# Altium schematic sheet cpu.SchDoc: CPU Scheme
size A3; Author: Daniele Basile <asterix24@gmail.com>; Organization: Altium Limited; Address1: L3, 12a Rodborough Rd; Address2: Frenchs Forest; Address3: NSW; Address4: Australia 2086; DocumentNumber: 1; Revision: Rev.A; SheetNumber: 1; SheetTotal: 2
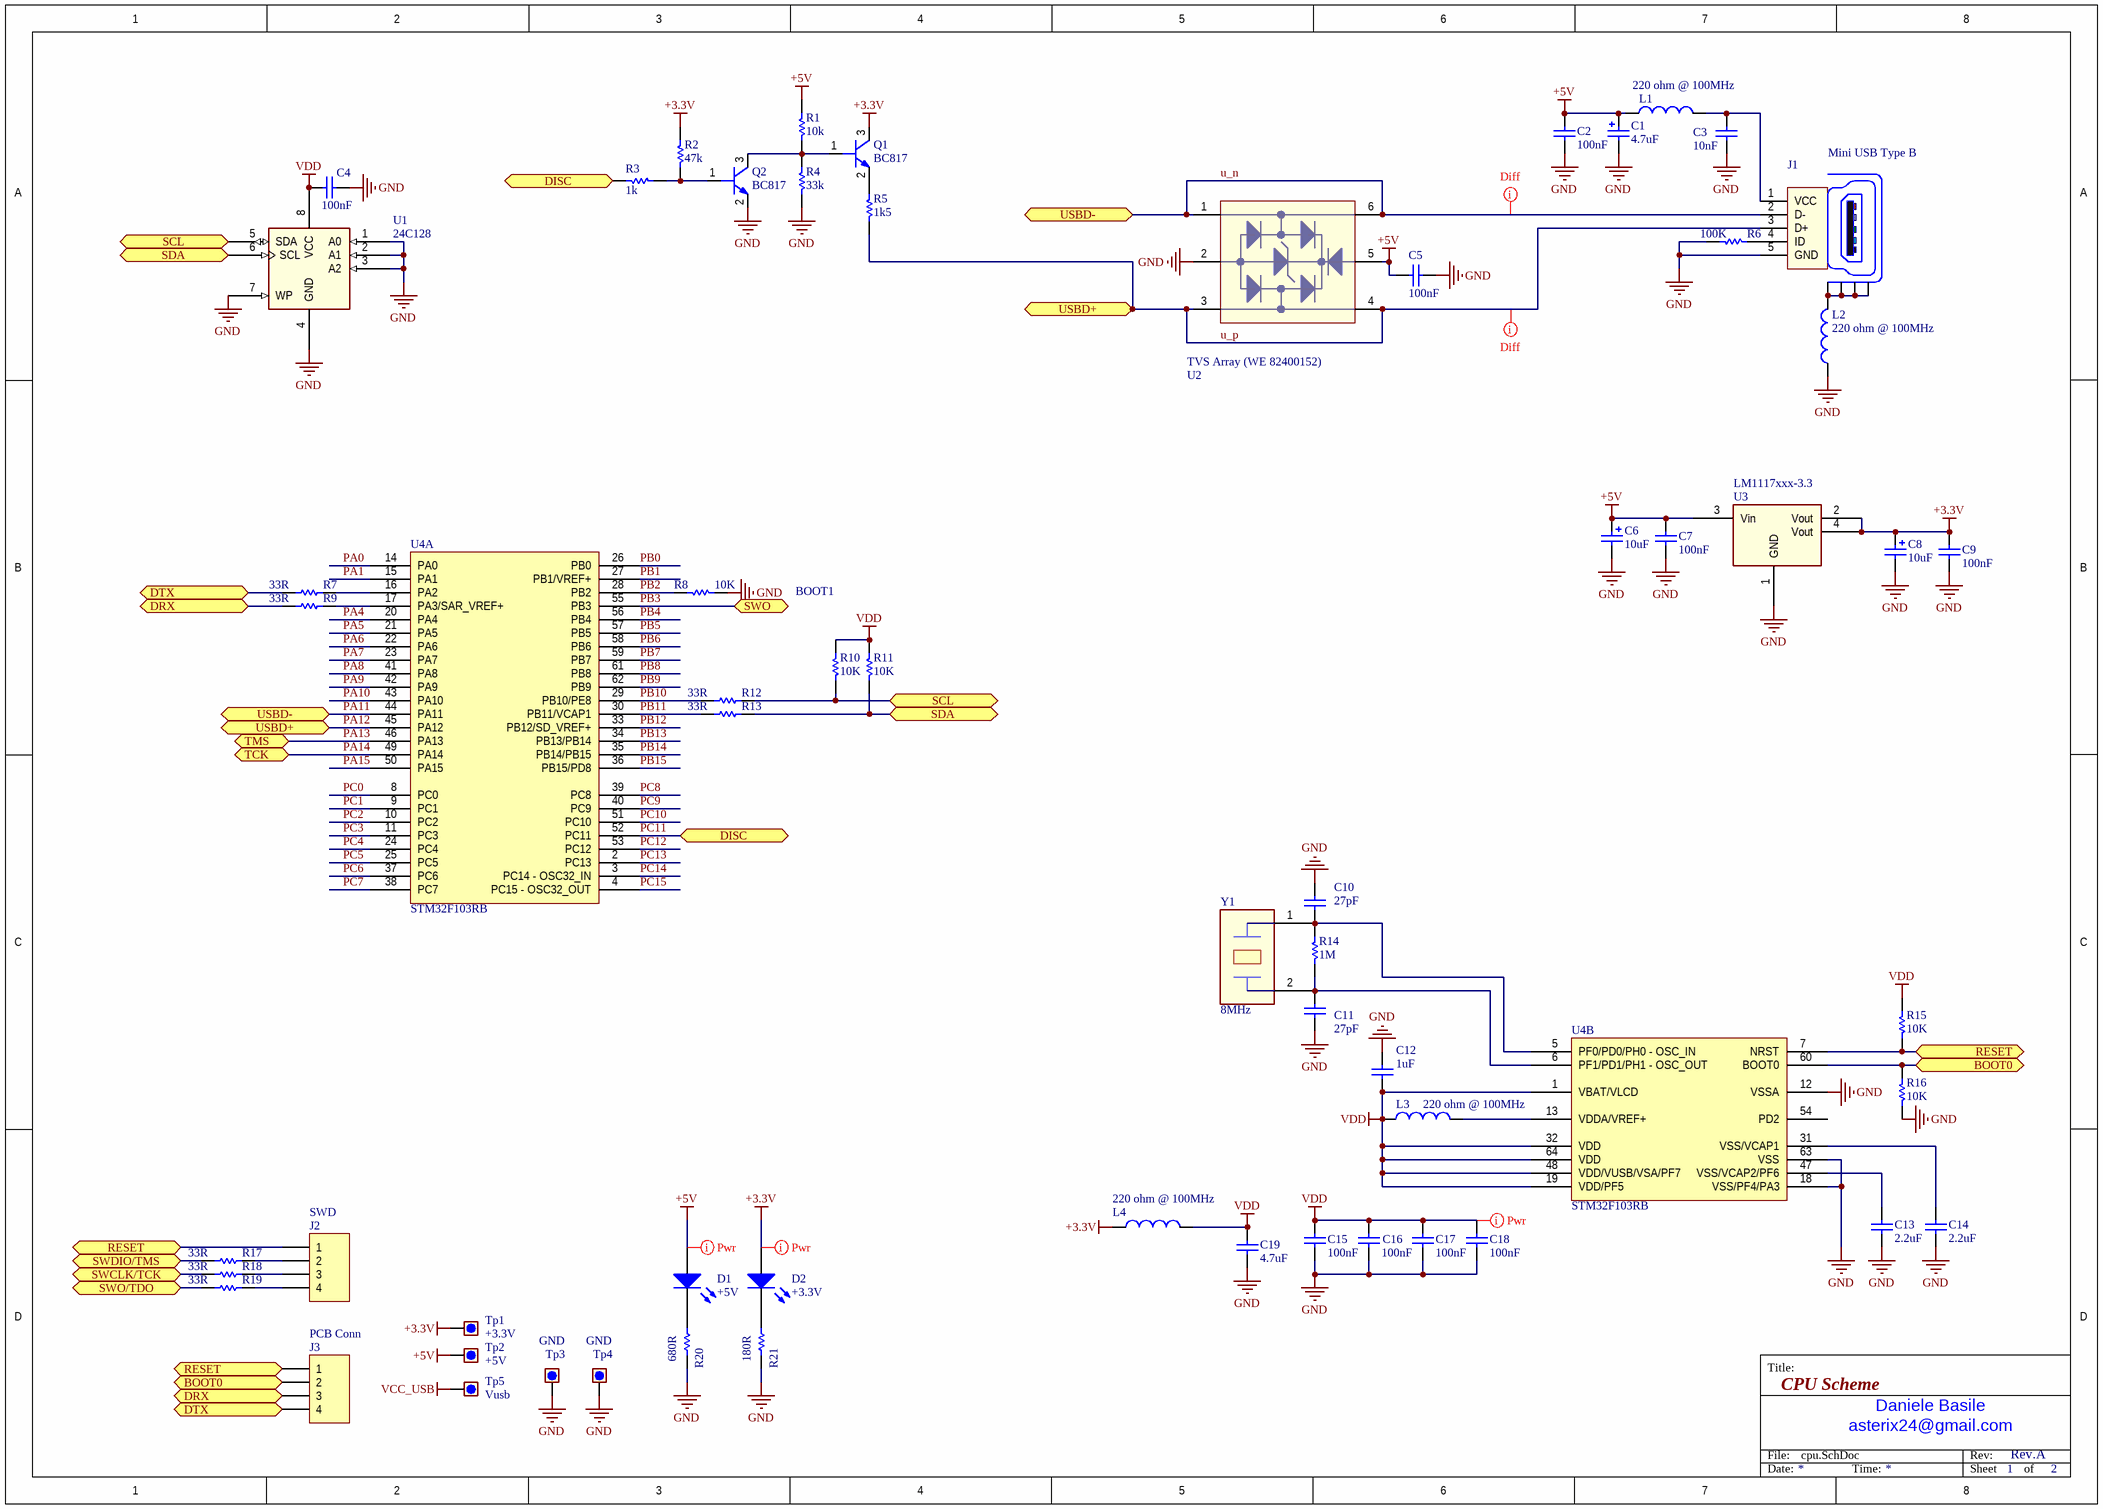
[diagram p0: cpu.SchDoc]

## Parts
C1  4.7uF  [1206_[3216]]
C2  100nF  [0603_[1608]]
C3  10nF  [0603_[1608]]
C4  100nF  [0603_[1608]]
C5  100nF  [0603_[1608]]
C6  10uF  [1206_[3216]]
C7  100nF  [0603_[1608]]
C8  10uF  [1206_[3216]]
C9  100nF  [0603_[1608]]
C10  27pF  [0603_[1608]]
C11  27pF  [0603_[1608]]
C12  1uF  [0603_[1608]]
C13  2.2uF  [0603_[1608]]
C14  2.2uF  [0603_[1608]]
C15  100nF  [0603_[1608]]
C16  100nF  [0603_[1608]]
C17  100nF  [0603_[1608]]
C18  100nF  [0603_[1608]]
C19  4.7uF  [0603_[1608]]
D1  +5V  [0603_[1608]_LED]
D2  +3.3V  [0603_[1608]_LED]
J1  Mini USB Type B  [usb_typeB_mini_smd]
J2  SWD  [HEADER_1X4_2.54MM_THD]
J3  PCB Conn  [HEADER_1X4_2.54MM_THD]
L1  220 ohm @ 100MHz  [0805_[2012]]
L2  220 ohm @ 100MHz  [0805_[2012]]
L3  220 ohm @ 100MHz  [0805_[2012]]
L4  220 ohm @ 100MHz  [0805_[2012]]
Q1  BC817  [SOT-23]
Q2  BC817  [SOT-23]
R1  10k  [0603_[1608]]
R2  47k  [0603_[1608]]
R3  1k  [0603_[1608]]
R4  33k  [0603_[1608]]
R5  1k5  [0603_[1608]]
R6  100K  [0603_[1608]]
R7  33R  [0603_[1608]]
R8  10K  [0603_[1608]]
R9  33R  [0603_[1608]]
R10  10K  [0603_[1608]]
R11  10K  [0603_[1608]]
R12  33R  [0603_[1608]]
R13  33R  [0603_[1608]]
R14  1M  [0603_[1608]]
R15  10K  [0603_[1608]]
R16  10K  [0603_[1608]]
R17  33R  [0603_[1608]]
R18  33R  [0603_[1608]]
R19  33R  [0603_[1608]]
R20  680R  [0603_[1608]]
R21  180R  [0603_[1608]]
Tp1  +3.3V  [TEST_POINT_THD_D1.8MM]  (no BOM)
Tp2  +5V  [TEST_POINT_THD_D1.8MM]  (no BOM)
Tp3  GND  [TEST_POINT_THD_D1.8MM]  (no BOM)
Tp4  GND  [TEST_POINT_THD_D1.8MM]  (no BOM)
Tp5  Vusb  [TEST_POINT_THD_D1.8MM]  (no BOM)
U1  24C128  [SOIC8]
U2  TVS Array (WE 82400152)  [SOT-563]
U3  LM1117xxx-3.3  [SOT-223]
U4  STM32F103RB  [TSQFP50P1200X1200X160-64N]  (parts A,B of 2)
Y1  8MHz  [CRYSTAL_HC49UP]

## Ports
BOOT0, DISC, DRX, DTX, RESET, SCL, SDA, SWCLK/TCK, SWDIO/TMS, SWO, SWO/TDO, TCK, TMS, USBD+, USBD-

## Nets
+3.3V: C8.1 C9.2 D2.1(A) L4.1 Q1.3(C) R2.1 Tp1.1 U3.2(Vout) U3.4(Vout)
+5V: C1.1 C2.1 C5.2 C6.1 C7.2 D1.1(A) L1.1 R1.1 Tp2.1 U2.5 U3.3(Vin)
GND: C1.2 C2.2 C3.2 C4.1 C5.1 C6.2 C7.1 C8.2 C9.1 C10.2 C11.2 C12.2 C13.1 C14.1 C15.2 C16.2 C17.2 C18.2 C19.1 J1.5(GND) L2.1 Q2.2(E) R4.2 R6.2 R8.2 R16.1 R20.1 R21.1 Tp3.1 Tp4.1 U1.1(A0) U1.2(A1) U1.3(A2) U1.4(GND) U1.7(WP) U2.2 U3.1(GND) U4.12(VSSA) U4.18(VSS/PF4/PA3) U4.63(VSS)
VCC_USB: Tp5.1
VDD: C4.2 C12.1 C15.1 C16.1 C17.1 C18.1 C19.2 L3.1 L4.2 R10.2 R11.2 R15.1 U1.8(VCC) U4.1(VBAT/VLCD) U4.19(VDD/PF5) U4.32(VDD) U4.48(VDD/VUSB/VSA/PF7) U4.64(VDD)
BOOT0: J3.2 R16.2 U4.60(BOOT0) ; port BOOT0
DRX: J3.3 R9.2 ; port DRX
DTX: J3.4 R7.2 ; port DTX
PA0: U4.14(PA0)
PA1: U4.15(PA1)
PA4: U4.20(PA4)
PA5: U4.21(PA5)
PA6: U4.22(PA6)
PA7: U4.23(PA7)
PA8: U4.41(PA8)
PA9: U4.42(PA9)
PA10: U4.43(PA10)
PA11: J1.2(D-) U2.1 U2.6 U4.44(PA11) ; port USBD-  [also labelled u_n]
PA12: J1.3(D+) R5.2 U2.3 U2.4 U4.45(PA12) ; port USBD+  [also labelled u_p]
PA13: U4.46(PA13) ; port TMS
PA14: U4.49(PA14) ; port TCK
PA15: U4.50(PA15)
PB0: U4.26(PB0)
PB1: U4.27(PB1/VREF+)
PB2: R8.1 U4.28(PB2)
PB3: U4.55(PB3) ; port SWO
PB4: U4.56(PB4)
PB5: U4.57(PB5)
PB6: U4.58(PB6)
PB7: U4.59(PB7)
PB8: U4.61(PB8)
PB9: U4.62(PB9)
PB10: R12.2 U4.29(PB10/PE8)
PB11: R13.2 U4.30(PB11/VCAP1)
PB12: U4.33(PB12/SD_VREF+)
PB13: U4.34(PB13/PB14)
PB14: U4.35(PB14/PB15)
PB15: U4.36(PB15/PD8)
PC0: U4.8(PC0)
PC1: U4.9(PC1)
PC2: U4.10(PC2)
PC3: U4.11(PC3)
PC4: U4.24(PC4)
PC5: U4.25(PC5)
PC6: U4.37(PC6)
PC7: U4.38(PC7)
PC8: U4.39(PC8)
PC9: U4.40(PC9)
PC10: U4.51(PC10)
PC11: R3.2 U4.52(PC11) ; port DISC
PC12: U4.53(PC12)
PC13: U4.2(PC13)
PC14: U4.3(PC14_-_OSC32_IN)
PC15: U4.4(PC15_-_OSC32_OUT)
RESET: J2.1 J3.1 R15.2 U4.7(NRST) ; port RESET
SCL: R10.1 R12.1 U1.5(SDA) ; port SCL
SDA: R11.1 R13.1 U1.6(SCL) ; port SDA
SWCLK/TCK: R18.2 ; port SWCLK/TCK
SWDIO/TMS: R17.2 ; port SWDIO/TMS
SWO/TDO: R19.2 ; port SWO/TDO
NetC3_1: C3.1 J1.1(VCC) L1.2
NetC10_1: C10.1 R14.2 U4.5(PF0/PD0/PH0_-_OSC_IN) Y1.1
NetC11_1: C11.1 R14.1 U4.6(PF1/PD1/PH1_-_OSC_OUT) Y1.2
NetC13_2: C13.2 U4.47(VSS/VCAP2/PF6)
NetC14_2: C14.2 U4.31(VSS/VCAP1)
NetD1_2: D1.2(K) R20.2
NetD2_2: D2.2(K) R21.2
NetJ1_4: J1.4(ID) R6.1
NetJ1_Z1: J1.Z1(Shield) J1.Z2(Shield) J1.Z3(Shield) J1.Z4(Shield) L2.2
NetJ2_2: J2.2 R17.1
NetJ2_3: J2.3 R18.1
NetJ2_4: J2.4 R19.1
NetL3_2: L3.2 U4.13(VDDA/VREF+)
NetQ1_1: Q1.1(B) Q2.3(C) R1.2 R4.1
NetQ1_2: Q1.2(E) R5.1
NetQ2_1: Q2.1(B) R2.2 R3.1
NetR7_1: R7.1 U4.16(PA2)
NetR9_1: R9.1 U4.17(PA3/SAR_VREF+)

Not connected (* = marked no-connect by the designer): U4 54(PD2)

## Layout directives
net class Power: +3.3V, +5V, VDD
net class usb2_diff: PA11, PA12

## Notes on the sheet
- BOOT1
- Title:
- File:
- asterix24@gmail.com
- Daniele Basile
- Rev:
- Date:
- Time:
- Sheet
- of

## Library data of the parts
C1 = Cap Pol1: Ceramic X7R 16V; Value: 10uF; Published: 8-Jun-2000; Revision: July-2002: Re-released for DXP Platform.; Publisher: Altium Limited
C2 C4 C15-C18 = Cap: Ceramic X7R 50V; Value: 10nF; Published: 8-Jun-2000; Revision: July-2002: Re-released for DXP Platform.; Publisher: Altium Limited
C3 = Cap: Ceramic X7R 50V; Published: 8-Jun-2000; Revision: July-2002: Re-released for DXP Platform.; Publisher: Altium Limited; Value: 10nF
C5 C7 C9 = Cap: Ceramic X7R 50V; Value: 100pF; Published: 8-Jun-2000; LatestRevisionDate: 17-Jul-2002; LatestRevisionNote: Re-released for DXP Platform.; PackageReference: RAD-0.3; Publisher: Altium Limited; PackageDescription: Radial Cap, Thru-Hole; 2 Leads; 0.3 in Pin Spacing
C6 C8 = Cap Pol1: Ceramic X5R 25V; Published: 8-Jun-2000; Revision: July-2002: Re-released for DXP Platform.; Publisher: Altium Limited; Value: 10uF
C10 C11 = Cap: Ceramic NP0 +/- 0.1; Value: 10nF; Published: 8-Jun-2000; Revision: July-2002: Re-released for DXP Platform.; Publisher: Altium Limited
C12 C19 = Cap: Ceramic X7R 16V; Value: 10nF; Published: 8-Jun-2000; Revision: July-2002: Re-released for DXP Platform.; Publisher: Altium Limited
C13 C14 = Cap: Ceramic 6.3V X7R; Value: 10nF; Published: 8-Jun-2000; Revision: July-2002: Re-released for DXP Platform.; Publisher: Altium Limited
D1 D2 = LED0: LED Green; Published: 8-Jun-2000; LatestRevisionDate: 08-Jul-2005; LatestRevisionNote: Mech Layer 1 removed.; PackageReference: LED-0; Publisher: Altium Limited; PackageDescription: LED; 2 Leads
J1 = USB_Con_Type_B_mini_SMT: Mini USB SMT Type B 5 Contacts; Manufacturer: Würth Elektronik eiSos GmbH; partNo: 65100516121; ComponentLink1 Description: Manufacturer; ComponentLink2 Description: Datasheet; NoPins: 5; ComponentLink1URL: http://www.we-online.de; ComponentLink2URL: http://katalog.we-online.de/em/datasheet/65100516121.pdf; Created by: Karrer Zheng; Created Date: 10/10/2014
J2 J3 = Header 4: Pin Header, 1x4, 2.54mm.; LatestRevisionDate: 17-Jul-2002; LatestRevisionNote: Re-released for DXP Platform.; Publisher: Altium Limited
L1 L2 L4 = Inductor: WE 742792022
L3 = Inductor: Value: 100uH; Published: 8-Jun-2000; Revision: July-2002: Re-released for DXP Platform.; Publisher: Altium Limited
Q1 Q2 = BC817: BJT NPN
R1 R2 R4 R5 R7-R19 = Res1: Resistor; Value: 1K; Published: 8-Jun-2000; Revision: July-2002: Re-released for DXP Platform.; Publisher: Altium Limited
R3 R20 R21 = Res1: Resistor; Revision: July-2002: Re-released for DXP Platform.
  R3: Published: 8-Jun-2000; Publisher: Altium Limited; Value: 1K
R6 = Resistor_ST: Resistor; Value: 10K
Tp1-Tp5 = Test_point: Test point
U1 = EEPROM-SOIC8: EEPROM
U2 = TVS_Diode_Array
U3 = LM1117-FIXED-OUT: LM1117 LDO Fixed output
Y1 = CRYSTAL-2p